# EAGLE design Black Box (EAGLE 9.6.2)
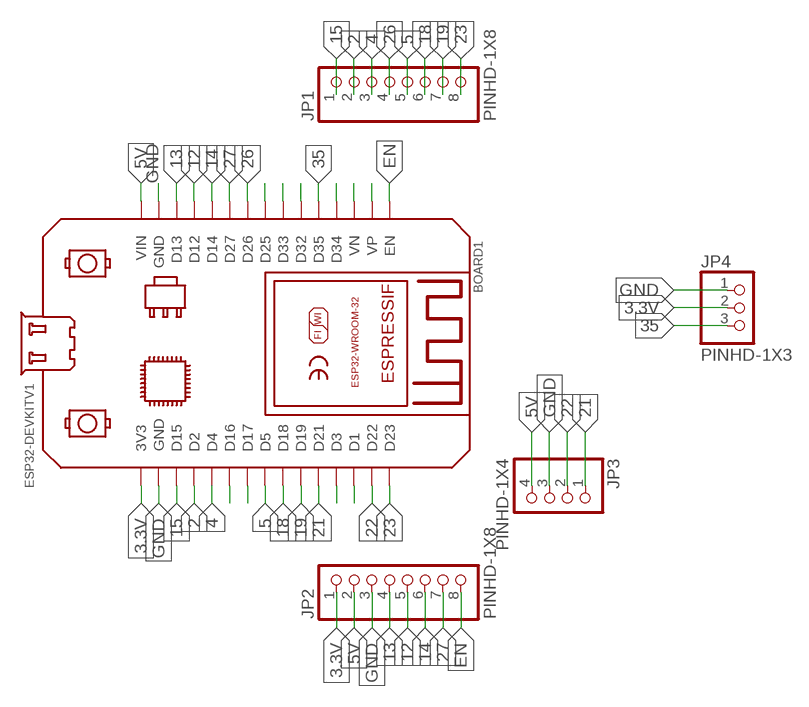
[diagram p0: schematic, sheet 1]

## Parts
BOARD1  ESP32DEVKITV1  [ESP32-DEVKITV1]
JP1  PINHD-1X8  [1X08]
JP2  PINHD-1X8  [1X08]
JP3  PINHD-1X4  [1X04]
JP4  PINHD-1X3  [1X03]

## Nets
2: BOARD1.D2 JP1.2
3.3V: BOARD1.3V3 JP2.1 JP4.2
4: BOARD1.D4 JP1.3
5: BOARD1.D5 JP1.5
5V: BOARD1.VIN JP2.2 JP3.4
12: BOARD1.D12 JP2.5
13: BOARD1.D13 JP2.4
14: BOARD1.D14 JP2.6
15: BOARD1.D15 JP1.1
18: BOARD1.D18 JP1.6
19: BOARD1.D19 JP1.7
21: BOARD1.D21 JP3.1
22: BOARD1.D22 JP3.2
23: BOARD1.D23 JP1.8
26: BOARD1.D26 JP1.4
27: BOARD1.D27 JP2.7
35: BOARD1.D35 JP4.3
EN: BOARD1.EN JP2.8
GND: BOARD1.GND BOARD1.GND@1(GND) JP2.3 JP3.3 JP4.1
N$9: BOARD1.D16
N$10: BOARD1.D17
N$15: BOARD1.D3
N$16: BOARD1.D1
N$20: BOARD1.VP
N$21: BOARD1.VN
N$22: BOARD1.D34
N$23: BOARD1.D32
N$25: BOARD1.D33
N$26: BOARD1.D25

## Library data of the parts
BOARD1 = ESP32-DEVKITV1:ESP32DEVKITV1: https://github.com/shridattdudhat
JP1 JP2 = Connector:PINHD-1X8: PIN HEADER; CATEGORY: CONNECTOR; SUB-CATEGORY: PIN-HEADER
JP3 = Connector:PINHD-1X4: PIN HEADER; CATEGORY: CONNECTOR; SUB-CATEGORY: PIN-HEADER
JP4 = Connector:PINHD-1X3: PIN HEADER; CATEGORY: CONNECTOR; SUB-CATEGORY: PIN-HEADER

## Net classes
0 default: clearance 0.762 mm

## Board
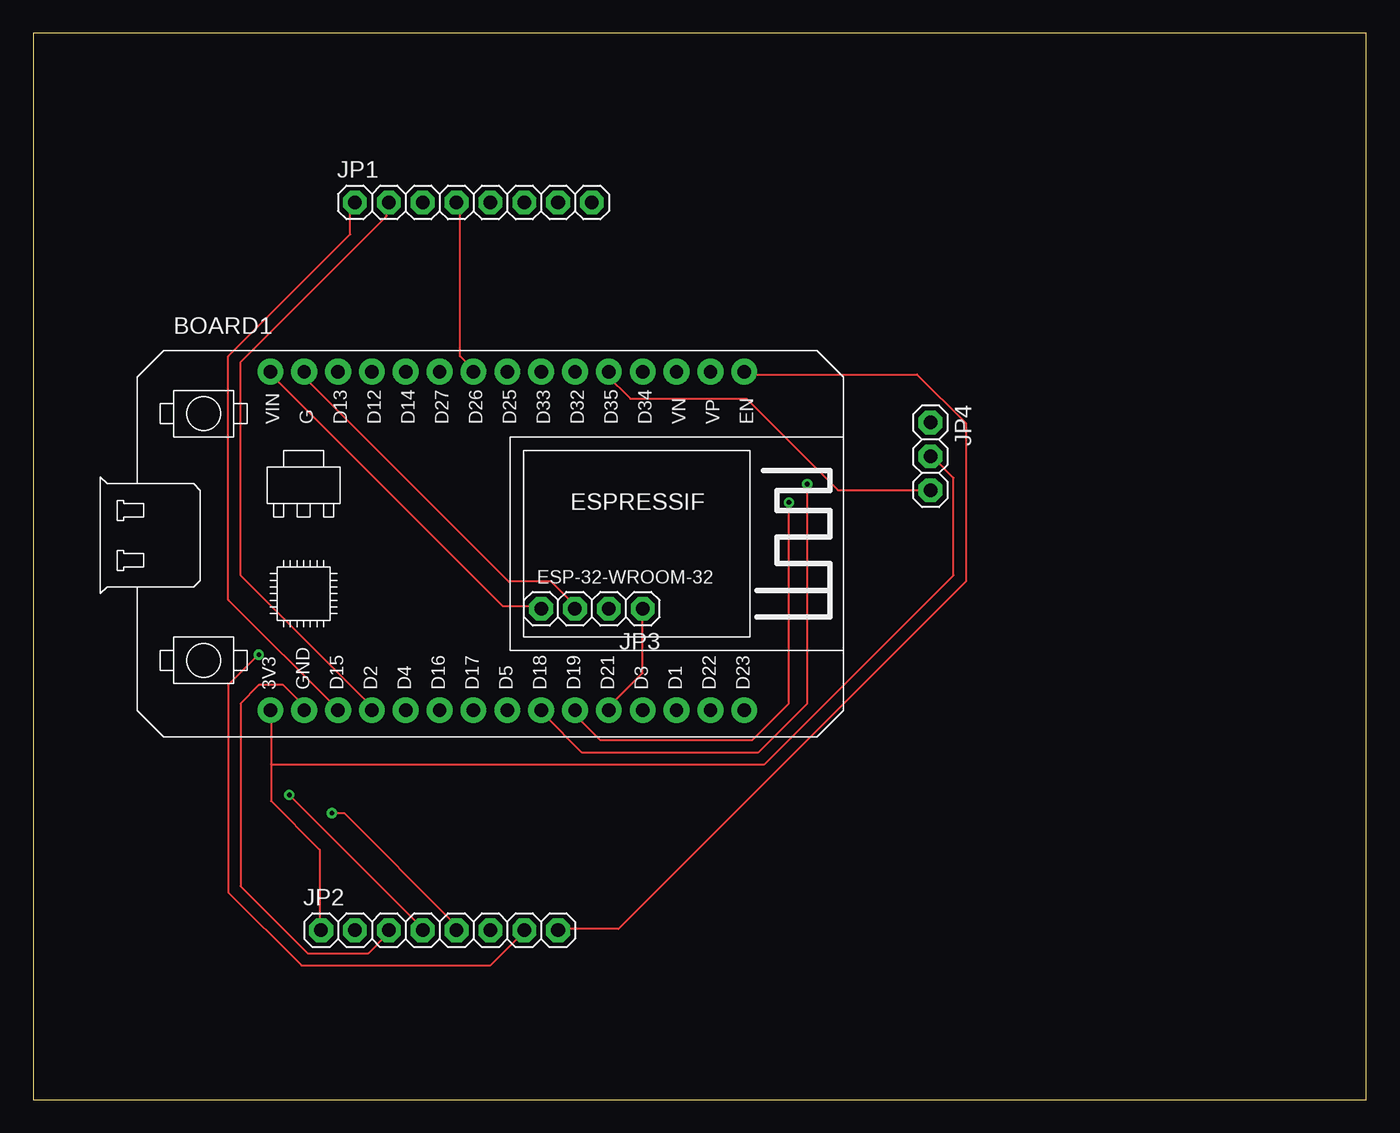
[diagram p1: board, top side]
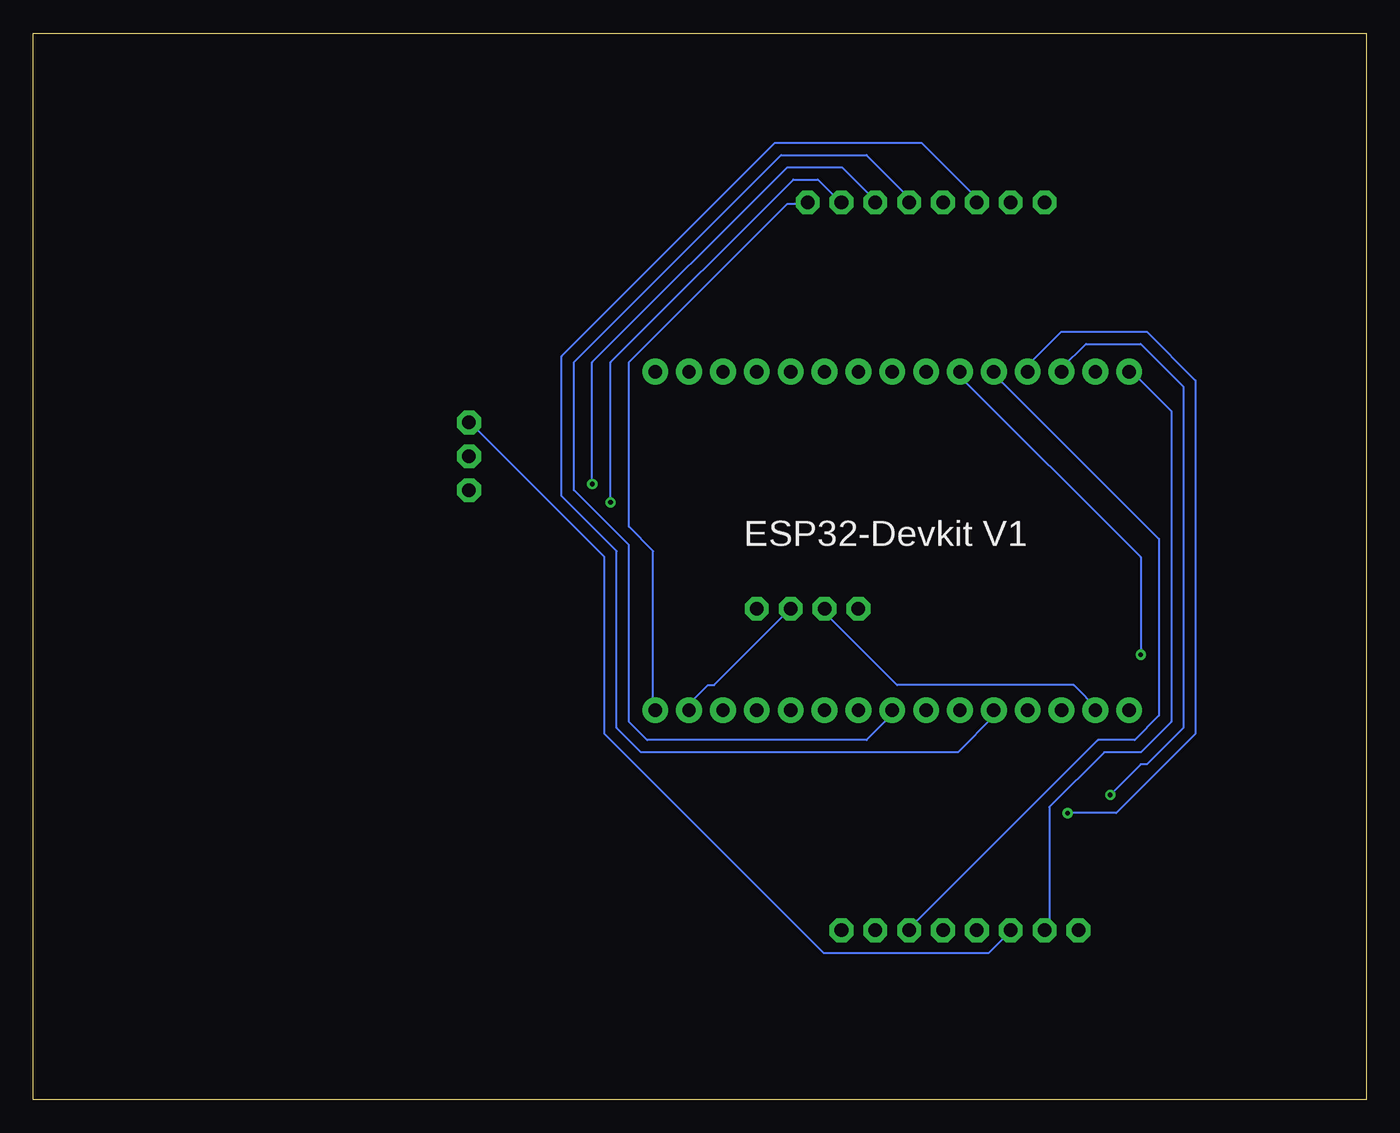
[diagram p2: board, bottom side, seen from below]

Size 100 x 80 mm. Coordinates in mm from the lower left corner, seen from the top.
Outline: 0,0 100,0 100,80 0,80 0,0
Copper layers (1*16): Top 0.035mm / dielectric 1.5mm / Bottom 0.035mm
Design rules "default": minimum track width 6mil, minimum drill 0.35mm, track to track 6mil, track to pad 6mil, pad to pad 6mil, via to via 6mil, smd to smd 6mil, copper to edge 40mil, drill to drill 6mil, minimum pad ring 10mil, minimum via ring 8mil, stop-mask expansion 4mil, vias tented up to drill 0mil, thermal gap 10mil

### Footprints (pad centres in the part's own frame; a part is rotated, then mirrored left to right if it is on the bottom)
ESP32-DEVKITV1 = drill 1 pad 1.93: 3V3 0,0; D1 30.48,0; D2 7.62,0; D3 27.94,0; D4 10.16,0; D5 17.78,0; D12 7.62,25.4; D13 5.08,25.4; D14 10.16,25.4; D15 5.08,0; D16 12.7,0; D17 15.24,0; D18 20.32,0; D19 22.86,0; D21 25.4,0; D22 33.02,0; D23 35.56,0; D25 17.78,25.4; D26 15.24,25.4; D27 12.7,25.4; D32 22.86,25.4; D33 20.32,25.4; D34 27.94,25.4; D35 25.4,25.4; EN 35.56,25.4; GND 2.54,25.4; GND@1 2.54,0; VIN 0,25.4; VN 30.48,25.4; VP 33.02,25.4
1X08 = drill 1.016 pad 1.778 octagon: 1 -8.89,0; 2 -6.35,0; 3 -3.81,0; 4 -1.27,0; 5 1.27,0; 6 3.81,0; 7 6.35,0; 8 8.89,0
1X04 = drill 1.016 pad 1.778 octagon: 1 -3.81,0; 2 -1.27,0; 3 1.27,0; 4 3.81,0
1X03 = drill 1.016 pad 1.778 octagon: 1 -2.54,0; 2 0,0; 3 2.54,0

### Placement (x,y rotation side)
BOARD1  17.78,29.21 0 top
JP1  33.02,67.31 0 top
JP2  30.48,12.7 0 top
JP3  41.91,36.83 180 top
JP4  67.31,48.26 270 top

### Tracks (layer width: path | path; a pad name or v marks a point on that pad's centre or on a via)
2
  Top 0.152: JP1.2 26.52,67.21 26.52,66.29 15.54,55.32 15.54,39.32 25.6,29.26 BOARD1.D2
3.3V
  Top 0.152: 17.83,25.15 17.83,28.8 BOARD1.3V3 | 17.83,25.15 17.83,22.4 21.49,18.75 21.49,12.8 JP2.1 | 17.83,25.15 54.86,25.15 69.04,39.32 69.04,46.63 67.67,48.01 JP4.2
4
  Bottom 0.152: JP1.3 29.26,67.67 33.38,71.78 44.35,71.78 60.35,55.78 60.35,45.26 56.24,41.15 56.24,27.89 54.41,26.06 30.63,26.06 27.89,28.8 BOARD1.D4
5
  Bottom 0.152: JP1.5 34.29,67.67 37.49,70.87 43.89,70.87 59.44,55.32 59.44,45.72 55.32,41.6 55.32,28.35 53.95,26.98 37.49,26.98 35.66,28.8 BOARD1.D5
5V
  Top 0.152: JP3.4 37.95,37.03 35.2,37.03 17.83,54.41 BOARD1.VIN
  Bottom 0.152: JP2.2 23.77,12.8 23.77,21.95 19.66,26.06 16.92,26.06 14.63,28.35 14.63,51.66 17.37,54.41 BOARD1.VIN
12  (via drill 0.35)
  Top 0.152: v22.4,21.49 23.32,21.49 31.55,13.26 31.55,12.8 JP2.5
  Bottom 0.152: v22.4,21.49 18.75,21.49 12.8,27.43 12.8,53.95 16.46,57.61 22.86,57.61 25.6,54.86 BOARD1.D12
13  (via drill 0.35)
  Top 0.152: v19.2,22.86 28.8,13.26 28.8,12.8 JP2.4
  Bottom 0.152: v19.2,22.86 16.92,25.15 16.46,25.15 13.72,27.89 13.72,53.49 16.92,56.69 21.03,56.69 22.86,54.86 BOARD1.D13
14
  Bottom 0.152: JP2.6 34.29,12.8 20.12,26.98 17.37,26.98 15.54,28.8 15.54,42.06 27.89,54.41 BOARD1.D14
15
  Top 0.152: JP1.1 23.77,67.21 23.77,64.92 14.63,55.78 14.63,37.49 22.86,29.26 BOARD1.D15
18  (via drill 0.35)
  Top 0.152: v58.06,46.18 58.06,29.72 54.41,26.06 41.15,26.06 38.41,28.8 BOARD1.D18
  Bottom 0.152: v58.06,46.18 58.06,55.32 43.43,69.95 39.32,69.95 37.03,67.67 JP1.6
19  (via drill 0.35)
  Top 0.152: v56.69,44.81 56.69,29.72 53.95,26.98 42.52,26.98 40.69,28.8 BOARD1.D19
  Bottom 0.152: v56.69,44.81 56.69,55.32 42.98,69.04 41.15,69.04 39.78,67.67 JP1.7
21
  Top 0.152: JP3.1 45.72,32 42.98,29.26 BOARD1.D21
22
  Bottom 0.152: JP3.2 48.92,31.09 49.38,31.09 51.21,29.26 BOARD1.D22
23
  Bottom 0.152: JP1.8 42.06,67.21 43.43,67.21 55.32,55.32 55.32,42.98 53.49,41.15 53.49,29.26 BOARD1.D23
26
  Top 0.152: JP1.4 32,67.21 32,55.78 32.92,54.86 BOARD1.D26
27  (via drill 0.35)
  Top 0.152: v16.92,33.38 14.63,31.09 14.63,15.54 20.12,10.06 34.29,10.06 36.58,12.34 JP2.7
  Bottom 0.152: v16.92,33.38 16.92,40.69 30.63,54.41 BOARD1.D27
35
  Top 0.152: JP4.3 60.35,45.72 53.49,52.58 44.81,52.58 42.98,54.41 BOARD1.D35
EN
  Top 0.152: JP2.8 39.78,12.8 43.89,12.8 69.95,38.86 69.95,50.75 66.29,54.41 53.49,54.41 BOARD1.EN
GND
  Top 0.152: JP2.3 26.52,12.34 25.15,10.97 20.57,10.97 15.54,16 15.54,29.72 16.92,31.09 18.75,31.09 20.57,29.26 BOARD1.GND@1 | BOARD1.GND 20.57,54.41 20.57,53.95 35.66,38.86 38.86,38.86 40.69,37.03 JP3.3
  Bottom 0.152: JP3.3 40.23,36.58 40.23,36.12 35.2,31.09 21.95,31.09 20.12,29.26 BOARD1.GND@1 | JP4.1 67.21,50.75 57.15,40.69 57.15,27.43 40.69,10.97 28.35,10.97 26.98,12.34 JP2.3